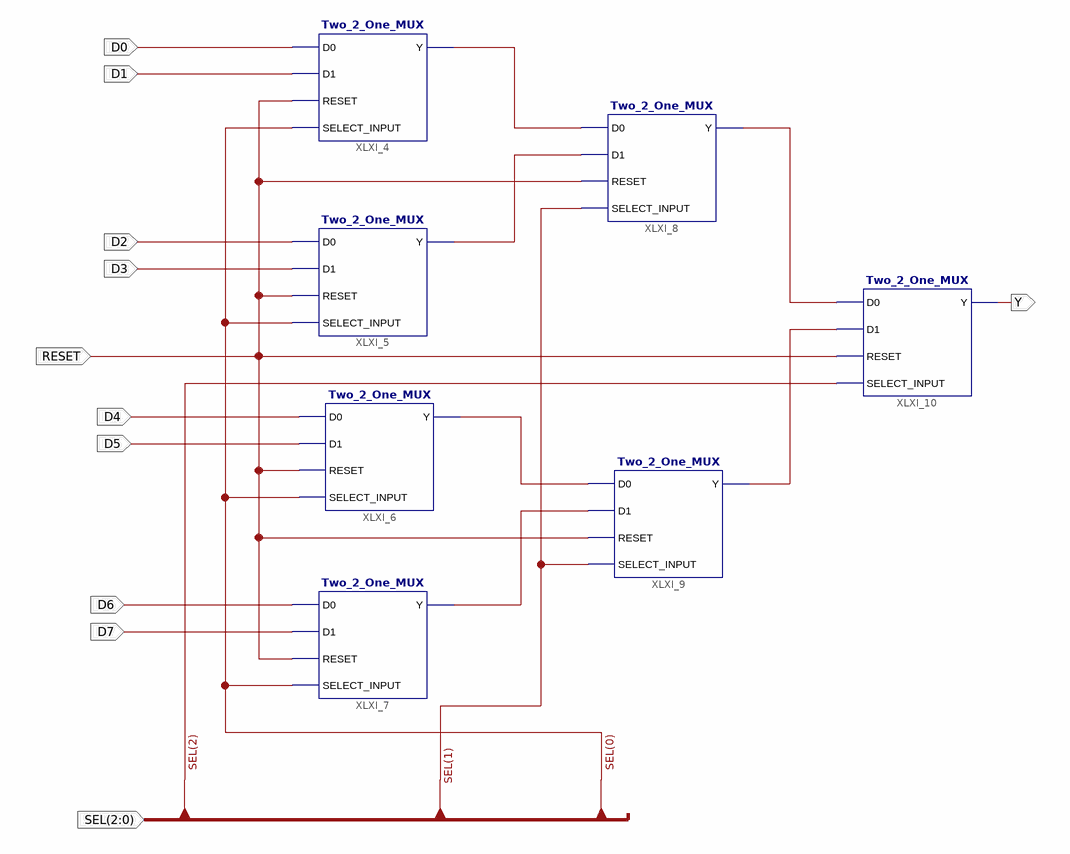
[diagram p0: schematic sheet 1]
// Xilinx ISE schematic Eight_2_One_MUX.sch (artix7) as structural Verilog: 7 symbols, 11 ports
module Eight_2_One_MUX (
  input  RESET,
  input  [2:0] SEL,
  input  D0,
  input  D1,
  input  D2,
  input  D3,
  input  D4,
  input  D5,
  input  D6,
  input  D7,
  output Y
);

  wire XLXN_11, XLXN_12, XLXN_13, XLXN_14, XLXN_15, XLXN_16;

  Two_2_One_MUX XLXI_4 (.D0(D0), .D1(D1), .RESET(RESET), .SELECT_INPUT(SEL[0]), .Y(XLXN_11));
  Two_2_One_MUX XLXI_5 (.D0(D2), .D1(D3), .RESET(RESET), .SELECT_INPUT(SEL[0]), .Y(XLXN_12));
  Two_2_One_MUX XLXI_6 (.D0(D4), .D1(D5), .RESET(RESET), .SELECT_INPUT(SEL[0]), .Y(XLXN_13));
  Two_2_One_MUX XLXI_7 (.D0(D6), .D1(D7), .RESET(RESET), .SELECT_INPUT(SEL[0]), .Y(XLXN_14));
  Two_2_One_MUX XLXI_8 (.D0(XLXN_11), .D1(XLXN_12), .RESET(RESET), .SELECT_INPUT(SEL[1]), .Y(XLXN_15));
  Two_2_One_MUX XLXI_9 (.D0(XLXN_13), .D1(XLXN_14), .RESET(RESET), .SELECT_INPUT(SEL[1]), .Y(XLXN_16));
  Two_2_One_MUX XLXI_10 (.D0(XLXN_15), .D1(XLXN_16), .RESET(RESET), .SELECT_INPUT(SEL[2]), .Y(Y));
endmodule
